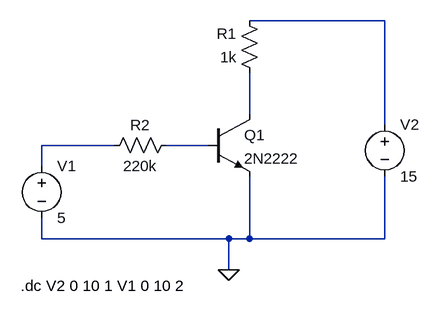
[diagram p0: schematic deriving_bjt_characteristic_curves_in_lt_spice.asc]
deriving_bjt_characteristic_curves_in_lt_spice.asc, the LTspice schematic file:
Version 4
SHEET 1 880 680
WIRE 272 -160 64 -160
WIRE 64 -16 64 -80
WIRE 272 0 272 -160
WIRE -144 32 -256 32
WIRE 0 32 -64 32
WIRE -256 64 -256 32
WIRE -256 176 -256 144
WIRE 32 176 -256 176
WIRE 64 176 64 80
WIRE 64 176 32 176
WIRE 272 176 272 80
WIRE 272 176 64 176
WIRE 32 224 32 176
FLAG 32 224 0
SYMBOL npn 0 -16 R0
SYMATTR InstName Q1
SYMATTR Value 2N2222
SYMBOL voltage -256 48 R0
WINDOW 123 0 0 Left 0
WINDOW 39 0 0 Left 0
SYMATTR InstName V1
SYMATTR Value 5
SYMBOL voltage 272 -16 R0
WINDOW 123 0 0 Left 0
WINDOW 39 0 0 Left 0
SYMATTR InstName V2
SYMATTR Value 15
SYMBOL res -48 16 R90
WINDOW 0 0 56 VBottom 2
WINDOW 3 32 56 VTop 2
SYMATTR InstName R2
SYMATTR Value 220k
SYMBOL res 80 -64 R180
WINDOW 0 36 76 Left 2
WINDOW 3 36 40 Left 2
SYMATTR InstName R1
SYMATTR Value 1k
TEXT -288 248 Left 2 !.dc V2 0 10 1 V1 0 10 2

The netlist it stands for:
* deriving_bjt_characteristic_curves_in_lt_spice.asc
Q1 N002 N004 0 0 2N2222
V1 N003 0 5
V2 N001 0 15
R2 N004 N003 220k
R1 N002 N001 1k
.model NPN NPN
.model PNP PNP
.lib standard.bjt
.dc V2 0 10 1 V1 0 10 2
.backanno
.end